# Altium schematic sheet 24VSensing.SchDoc
size A
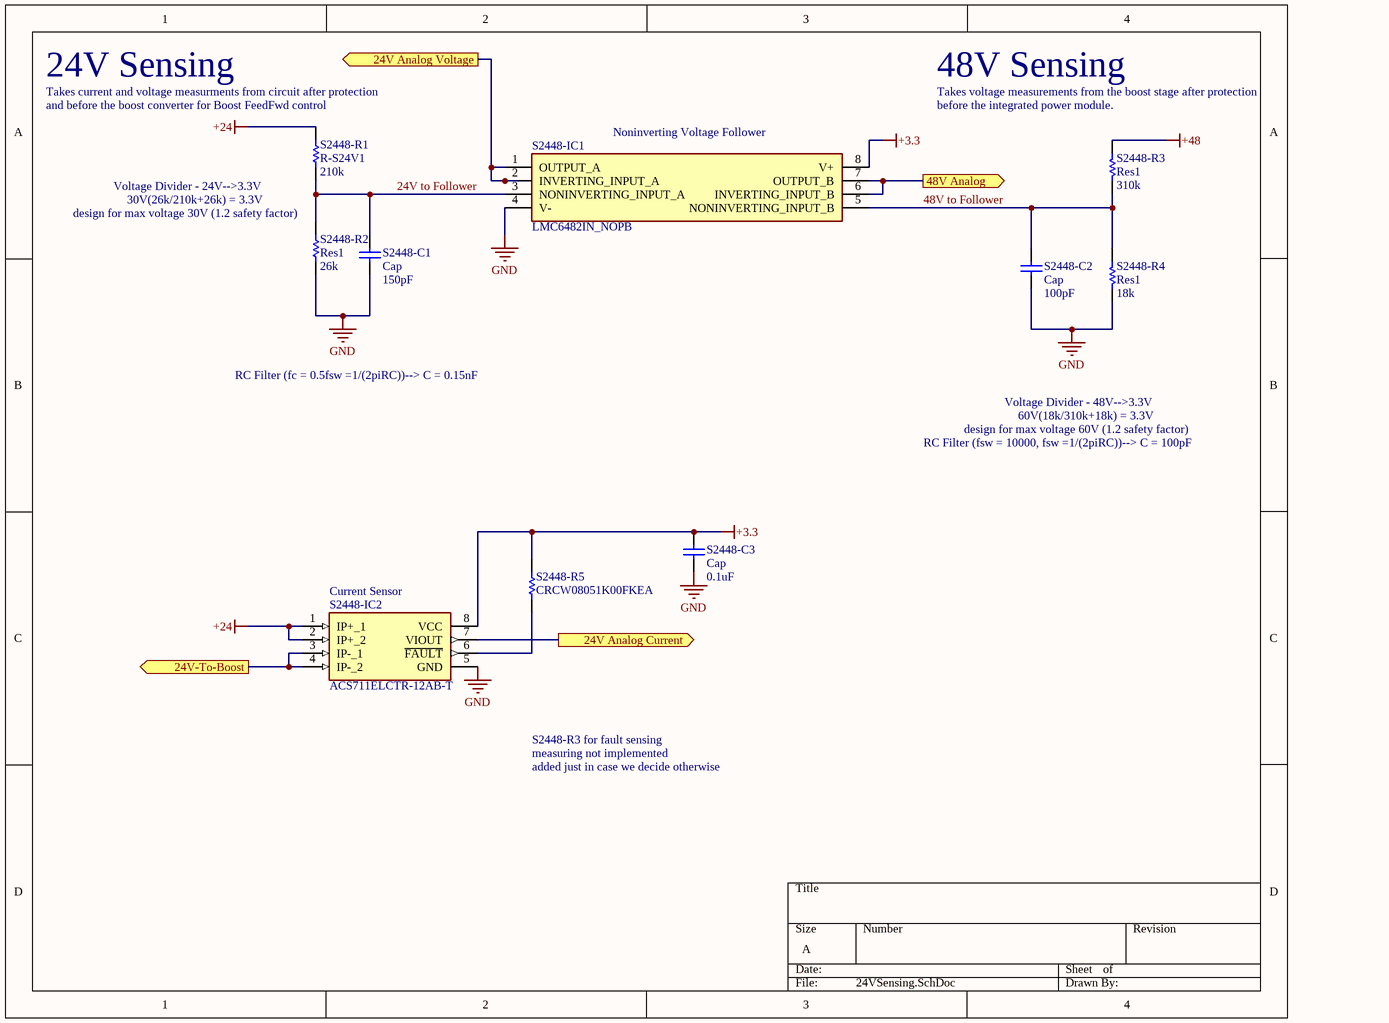
[diagram p0: 24VSensing.SchDoc]

## Parts
S2448-C1  Cap  value 150pF  [RAD-0.3]
S2448-C2  Cap  value 100pF  [RAD-0.3]
S2448-C3  Cap  value 0.1uF  [RAD-0.3]
S2448-IC1  LMC6482IN_NOPB  [DIP794W53P254L959H508Q8N]
S2448-IC2  ACS711ELCTR-12AB-T  [SOIC127P600X175-8N]
S2448-R1  R-S24V1  value 210k  [AXIAL-0.3]
S2448-R2  Res1  value 26k  [AXIAL-0.3]
S2448-R3  Res1  value 310k  [AXIAL-0.3]
S2448-R4  Res1  value 18k  [AXIAL-0.3]
S2448-R5  CRCW08051K00FKEA  [RESC2013X50X30NL20T20]

## Ports
24V Analog Current (out), 24V Analog Voltage (out), 24V-To-Boost (out), 48V Analog (out)

## Nets
+3.3: S2448-C3.2 S2448-IC1.8(V+) S2448-IC2.8(VCC) S2448-R5.2
+24: S2448-IC2.1(IP+_1) S2448-IC2.2(IP+_2) S2448-R1.2
+48: S2448-R3.2
GND: S2448-C1.1 S2448-C2.1 S2448-C3.1 S2448-IC1.4(V-) S2448-IC2.5(GND) S2448-R2.1 S2448-R4.1
24V Analog Current: S2448-IC2.7(VIOUT) ; port 24V Analog Current
24V Analog Voltage: S2448-IC1.1(OUTPUT_A) S2448-IC1.2(INVERTING_INPUT_A) ; port 24V Analog Voltage
24V to Follower: S2448-C1.2 S2448-IC1.3(NONINVERTING_INPUT_A) S2448-R1.1 S2448-R2.2
24V-To-Boost: S2448-IC2.3(IP-_1) S2448-IC2.4(IP-_2) ; port 24V-To-Boost
48V Analog: S2448-IC1.6(INVERTING_INPUT_B) S2448-IC1.7(OUTPUT_B) ; port 48V Analog
48V to Follower: S2448-C2.2 S2448-IC1.5(NONINVERTING_INPUT_B) S2448-R3.1 S2448-R4.2
NetS2448-IC2_6: S2448-IC2.6(~{FAULT}) S2448-R5.1

## Notes on the sheet
- 24V Sensing
- (near S2448-R1) Takes current and voltage measurments from circuit after protection
- 48V Sensing
- Takes voltage measurements from the boost stage after protection
- (near S2448-R1) and before the boost converter for Boost FeedFwd control
- (near S2448-IC1) Noninverting Voltage Follower
- (near S2448-R3) before the integrated power module.
- (near S2448-R2) design for max voltage 30V (1.2 safety factor)
- Voltage Divider - 24V-->3.3V
- 30V(26k/210k+26k) = 3.3V
- RC Filter (fc = 0.5fsw =1/(2piRC))--> C = 0.15nF
- design for max voltage 60V (1.2 safety factor)
- Voltage Divider - 48V-->3.3V
- 60V(18k/310k+18k) = 3.3V
- RC Filter (fsw = 10000, fsw =1/(2piRC))--> C = 100pF
- (near S2448-IC2) Current Sensor
- S2448-R3 for fault sensing
- measuring not implemented
- added just in case we decide otherwise

## Library data of the parts
S2448-C1-S2448-C3 = Cap: Capacitor; Published: 8-Jun-2000; LatestRevisionDate: 17-Jul-2002; LatestRevisionNote: Re-released for DXP Platform.; PackageReference: RAD-0.3; Publisher: Altium Limited; PackageDescription: Radial Cap, Thru-Hole; 2 Leads; 0.3 in Pin Spacing
S2448-IC1 = LMC6482IN_NOPB: Integrated Circuit; Manufacturer_Name: Texas Instruments; Manufacturer_Part_Number: LMC6482IN/NOPB; Datasheet Link: http://www.ti.com/lit/gpn/lmc6482; Height: 5.08mm; Mouser Part Number: 926-LMC6482IN/NOPB; Mouser Price/Stock: https://www.mouser.co.uk/ProductDetail/Texas-Instruments/LMC6482IN-NOPB?qs=QbsRYf82W3EByDDrj8Vijg%3D%3D; Arrow Part Number: LMC6482IN/NOPB; Arrow Price/Stock: https://www.arrow.com/en/products/lmc6482innopb/texas-instruments
S2448-IC2 = ACS711ELCTR-12AB-T: Integrated Circuit; Manufacturer_Name: Allegro Microsystems; Datasheet Link: https://www.allegromicro.com/~/media/Files/Datasheets/ACS711-Datasheet.ashx; Height: 1.75mm; Manufacturer_Part_Number: ACS711ELCTR-12AB-T; Arrow Part Number: ACS711ELCTR-12AB-T; Arrow Price/Stock: https://www.arrow.com/en/products/acs711elctr-12ab-t/allegro-microsystems
S2448-R1-S2448-R4 = Res1: Resistor; Published: 8-Jun-2000; LatestRevisionDate: 17-Jul-2002; LatestRevisionNote: Re-released for DXP Platform.; PackageReference: AXIAL-0.3; Publisher: Altium Limited; PackageDescription: Axial Device, Thru-Hole; 2 Leads; 0.3 in Pin Spacing
S2448-R5 = CMP-1013-00510-2: Manufacturer: Vishay Dale; Part Number: CRCW08051K00FKEA